# Altium schematic sheet Dogfish3D - Systyem.SchDoc
size B
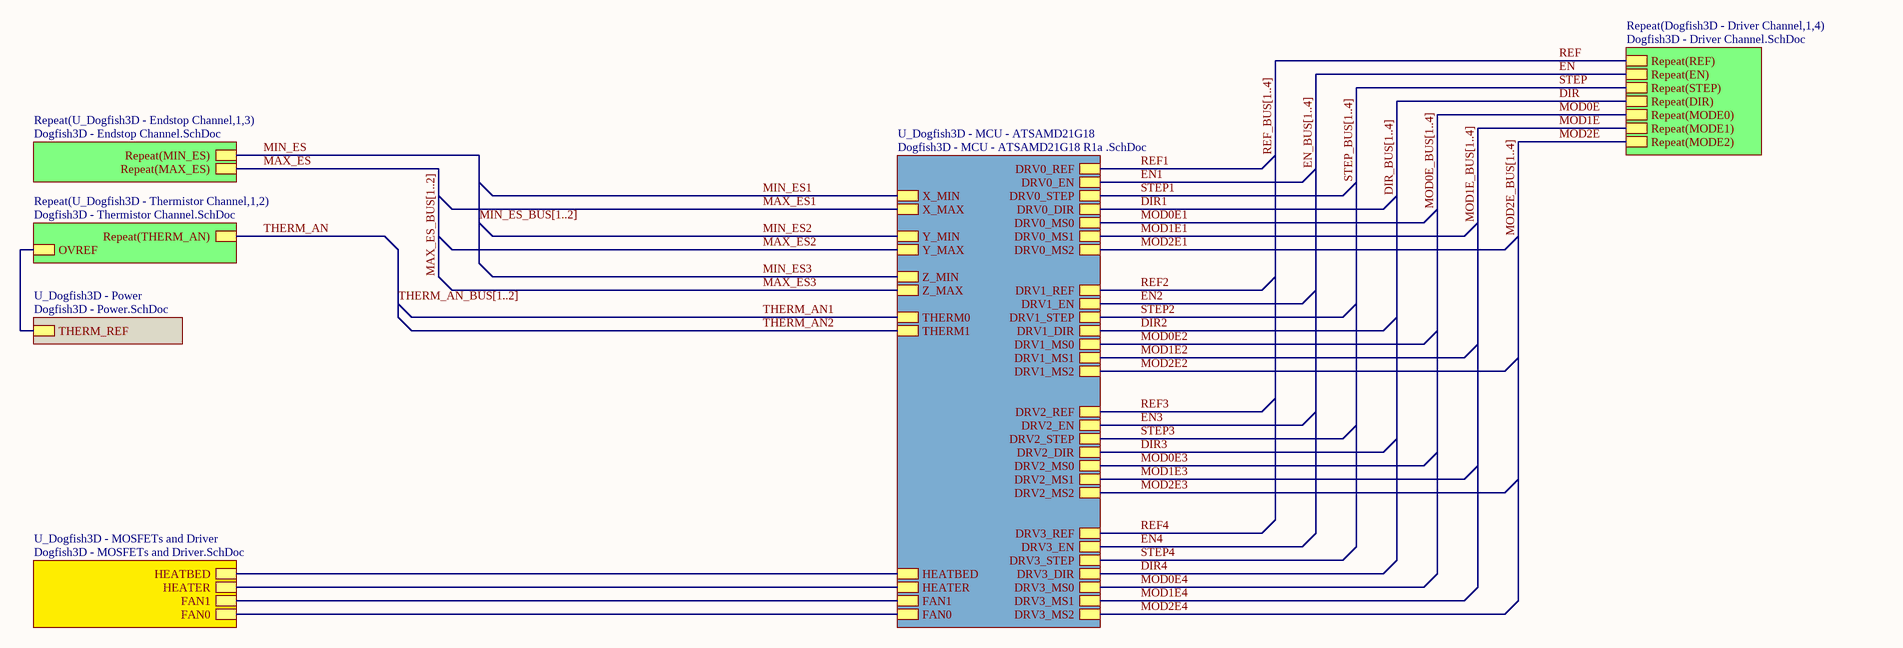
[diagram p0: Dogfish3D - Systyem.SchDoc]

## Sub-sheets
Repeat(Dogfish3D - Driver Channel,1,4) = Dogfish3D - Driver Channel.SchDoc: Repeat(REF), Repeat(EN), Repeat(STEP), Repeat(DIR), Repeat(MODE0), Repeat(MODE1), Repeat(MODE2)
Repeat(U_Dogfish3D - Endstop Channel,1,3) = Dogfish3D - Endstop Channel.SchDoc: Repeat(MAX_ES), Repeat(MIN_ES)
Repeat(U_Dogfish3D - Thermistor Channel,1,2) = Dogfish3D - Thermistor Channel.SchDoc: OVREF, Repeat(THERM_AN)
U_Dogfish3D - MCU - ATSAMD21G18 = Dogfish3D - MCU - ATSAMD21G18 R1a .SchDoc: DRV0_EN, DRV0_DIR, DRV0_STEP, DRV0_MS0, DRV0_MS1, DRV0_MS2, DRV0_REF, DRV1_EN, DRV1_DIR, DRV1_STEP, DRV1_MS0, DRV1_MS1, DRV1_MS2, DRV1_REF, DRV2_EN, DRV2_DIR, DRV2_STEP, DRV2_MS0, DRV2_MS1, DRV2_MS2, DRV2_REF, DRV3_EN, DRV3_DIR, DRV3_STEP, DRV3_MS0, DRV3_MS1, DRV3_MS2, DRV3_REF, THERM0, THERM1, X_MAX, X_MIN, Y_MAX, Y_MIN, Z_MAX, Z_MIN, FAN0, FAN1, HEATER, HEATBED
U_Dogfish3D - MOSFETs and Driver = Dogfish3D - MOSFETs and Driver.SchDoc: FAN0, FAN1, HEATER, HEATBED
U_Dogfish3D - Power = Dogfish3D - Power.SchDoc: THERM_REF

## Nets
DIR: sheet Repeat(Dogfish3D - Driver Channel,1,4)/Repeat(DIR)
DIR1: sheet U_Dogfish3D - MCU - ATSAMD21G18/DRV0_DIR
DIR2: sheet U_Dogfish3D - MCU - ATSAMD21G18/DRV1_DIR
DIR3: sheet U_Dogfish3D - MCU - ATSAMD21G18/DRV2_DIR
DIR4: sheet U_Dogfish3D - MCU - ATSAMD21G18/DRV3_DIR
EN: sheet Repeat(Dogfish3D - Driver Channel,1,4)/Repeat(EN)
EN1: sheet U_Dogfish3D - MCU - ATSAMD21G18/DRV0_EN
EN2: sheet U_Dogfish3D - MCU - ATSAMD21G18/DRV1_EN
EN3: sheet U_Dogfish3D - MCU - ATSAMD21G18/DRV2_EN
EN4: sheet U_Dogfish3D - MCU - ATSAMD21G18/DRV3_EN
MAX_ES: sheet Repeat(U_Dogfish3D - Endstop Channel,1,3)/Repeat(MAX_ES)
MAX_ES1: sheet U_Dogfish3D - MCU - ATSAMD21G18/X_MAX
MAX_ES2: sheet U_Dogfish3D - MCU - ATSAMD21G18/Y_MAX
MAX_ES3: sheet U_Dogfish3D - MCU - ATSAMD21G18/Z_MAX
MIN_ES: sheet Repeat(U_Dogfish3D - Endstop Channel,1,3)/Repeat(MIN_ES)
MIN_ES1: sheet U_Dogfish3D - MCU - ATSAMD21G18/X_MIN
MIN_ES2: sheet U_Dogfish3D - MCU - ATSAMD21G18/Y_MIN
MIN_ES3: sheet U_Dogfish3D - MCU - ATSAMD21G18/Z_MIN
MOD0E: sheet Repeat(Dogfish3D - Driver Channel,1,4)/Repeat(MODE0)
MOD0E1: sheet U_Dogfish3D - MCU - ATSAMD21G18/DRV0_MS0
MOD0E2: sheet U_Dogfish3D - MCU - ATSAMD21G18/DRV1_MS0
MOD0E3: sheet U_Dogfish3D - MCU - ATSAMD21G18/DRV2_MS0
MOD0E4: sheet U_Dogfish3D - MCU - ATSAMD21G18/DRV3_MS0
MOD1E: sheet Repeat(Dogfish3D - Driver Channel,1,4)/Repeat(MODE1)
MOD1E1: sheet U_Dogfish3D - MCU - ATSAMD21G18/DRV0_MS1
MOD1E2: sheet U_Dogfish3D - MCU - ATSAMD21G18/DRV1_MS1
MOD1E3: sheet U_Dogfish3D - MCU - ATSAMD21G18/DRV2_MS1
MOD1E4: sheet U_Dogfish3D - MCU - ATSAMD21G18/DRV3_MS1
MOD2E: sheet Repeat(Dogfish3D - Driver Channel,1,4)/Repeat(MODE2)
MOD2E1: sheet U_Dogfish3D - MCU - ATSAMD21G18/DRV0_MS2
MOD2E2: sheet U_Dogfish3D - MCU - ATSAMD21G18/DRV1_MS2
MOD2E3: sheet U_Dogfish3D - MCU - ATSAMD21G18/DRV2_MS2
MOD2E4: sheet U_Dogfish3D - MCU - ATSAMD21G18/DRV3_MS2
REF: sheet Repeat(Dogfish3D - Driver Channel,1,4)/Repeat(REF)
REF1: sheet U_Dogfish3D - MCU - ATSAMD21G18/DRV0_REF
REF2: sheet U_Dogfish3D - MCU - ATSAMD21G18/DRV1_REF
REF3: sheet U_Dogfish3D - MCU - ATSAMD21G18/DRV2_REF
REF4: sheet U_Dogfish3D - MCU - ATSAMD21G18/DRV3_REF
STEP: sheet Repeat(Dogfish3D - Driver Channel,1,4)/Repeat(STEP)
STEP1: sheet U_Dogfish3D - MCU - ATSAMD21G18/DRV0_STEP
STEP2: sheet U_Dogfish3D - MCU - ATSAMD21G18/DRV1_STEP
STEP3: sheet U_Dogfish3D - MCU - ATSAMD21G18/DRV2_STEP
STEP4: sheet U_Dogfish3D - MCU - ATSAMD21G18/DRV3_STEP
THERM_AN: sheet Repeat(U_Dogfish3D - Thermistor Channel,1,2)/Repeat(THERM_AN)
THERM_AN1: sheet U_Dogfish3D - MCU - ATSAMD21G18/THERM0
THERM_AN2: sheet U_Dogfish3D - MCU - ATSAMD21G18/THERM1
(unnamed): sheet U_Dogfish3D - MOSFETs and Driver/FAN0, sheet U_Dogfish3D - MCU - ATSAMD21G18/FAN0
(unnamed): sheet U_Dogfish3D - MOSFETs and Driver/FAN1, sheet U_Dogfish3D - MCU - ATSAMD21G18/FAN1
(unnamed): sheet U_Dogfish3D - MOSFETs and Driver/HEATER, sheet U_Dogfish3D - MCU - ATSAMD21G18/HEATER
(unnamed): sheet U_Dogfish3D - MOSFETs and Driver/HEATBED, sheet U_Dogfish3D - MCU - ATSAMD21G18/HEATBED
(unnamed): sheet U_Dogfish3D - Power/THERM_REF, sheet Repeat(U_Dogfish3D - Thermistor Channel,1,2)/OVREF

## Buses and harness runs
bus DIR_BUS[1..4]
bus EN_BUS[1..4]
bus MAX_ES_BUS[1..2]
bus MIN_ES_BUS[1..2]
bus MOD0E_BUS[1..4]
bus MOD1E_BUS[1..4]
bus MOD2E_BUS[1..4]
bus REF_BUS[1..4]
bus STEP_BUS[1..4]
bus THERM_AN_BUS[1..2]